# EAGLE design RS232toTTL (EAGLE 5.09)
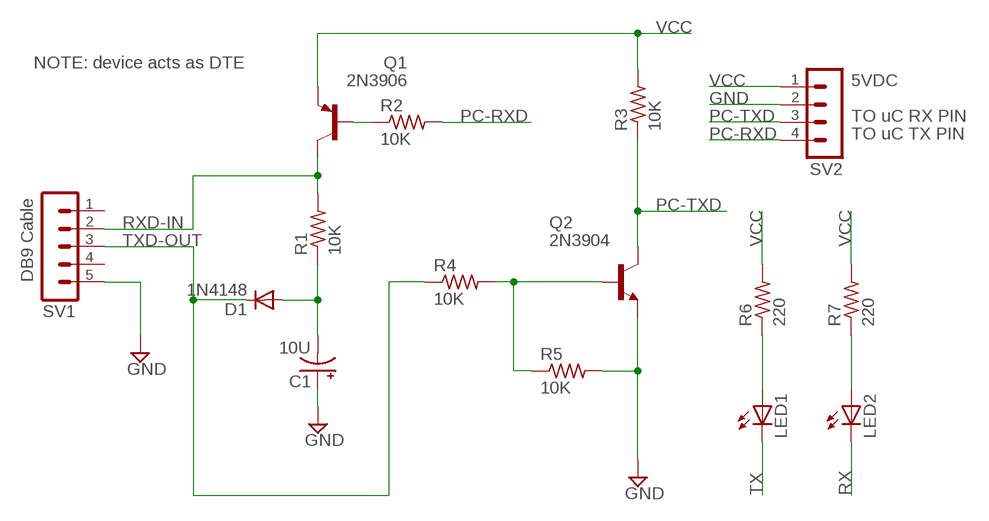
[diagram p0: schematic, sheet 1]

## Parts
C1  10U  CPOL-USE2.5-5  [E2,5-5]
D1  1N4148  1N4148DO35-7  [DO35-7]
LED1  LED5MM  [LED5MM]
LED2  LED5MM  [LED5MM]
Q1  2N3906  [TO92]
Q2  2N3904  [TO92]
R1  10K  R-US_0207/10  [0207/10]
R2  10K  R-US_0207/10  [0207/10]
R3  10K  R-US_0207/10  [0207/10]
R4  10K  R-US_0207/10  [0207/10]
R5  10K  R-US_0207/10  [0207/10]
R6  220  R-US_0207/10  [0207/10]
R7  220  R-US_0207/10  [0207/10]
SV1  MA05-1  [MA05-1]
SV2  MA04-1  [MA04-1]

## Nets
GND: C1.+ Q2.3(E) R5.2 SV1.5 SV2.2
N$1: Q2.2(B) R4.2 R5.1
N$3: Q1.2(B) R2.1
N$6: LED1.A R6.1
N$7: C1.- D1.A R1.1
N$9: LED2.A R7.1
PC-RXD: R2.2 SV2.4
PC-TXD: Q2.1(C) R3.1 SV2.3
RX: LED2.K(C)
RXD-IN: Q1.1(C) R1.2 SV1.2
TX: LED1.K(C)
TXD-OUT: D1.C R4.1 SV1.3
VCC: Q1.3(E) R3.2 R6.2 R7.2 SV2.1
Unconnected: SV1.1 SV1.4

## Notes on the sheet
- NOTE: device acts as DTE
- 5VDC
- TO uC RX PIN
- TO uC TX PIN
- DB9 Cable

## Library data of the parts
C1 = rcl:CPOL-US: POLARIZED CAPACITOR, American symbol
D1 = diode:1N4148: DIODE high speed (Philips)
LED1 LED2 = led:LED: LED OSRAM: - CHIPLED LG R971, LG N971, LY N971, LG Q971, LY Q971, LO R971, LY R971 LH N974, LH R974 LS Q976, LO Q976, LY Q976 LO Q996 - Hyper CHIPLED LW Q18S LB Q993, LB Q99A, LB R99A - SideLED LS A670, LO A670, LY A670, LG A670, LP A670 LB A673, LV A673, LT A673, LW A673 LH A674 LY A675 LS A676, LA A676, LO A676, LY A676, LW A676 LS A679, LY A679, LG A679 - Hyper Micro SIDELED® LS Y876, LA Y876, LO Y876, LY Y876 LT Y87S - SmartLED LW L88C, LW L88S LB L89C, LB L89S, LG L890 LS L89K, LO L89K, LY L89K LS L896, LA L896, LO L896, LY L896 - TOPLED LS T670, LO T670, LY T670, LG T670, LP T670 LSG T670, LSP T670, LSY T670, LOP T670, LYG T670 LG T671, LOG T671, LSG T671 LB T673, LV T673, LT T673, LW T673 LH T674 LS T676, LA T676, LO T676, LY T676, LB T676, LH T676, LSB T676, LW T676 LB T67C, LV T67C, LT T67C, LS T67K, LO T67K, LY T67K, LW E67C LS E67B, LA E67B, LO E67B, LY E67B, LB E67C, LV E67C, LT E67C LW T67C LS T679, LY T679, LG T679 LS T770, LO T770, LY T770, LG T770, LP T770 LB T773, LV T773, LT T773, LW T773 LH T774 LS E675, LA E675, LY E675, LS T675 LS T776, LA T776, LO T776, LY T776, LB T776 LHGB T686 LT T68C, LB T68C - Hyper Mini TOPLED® LB M676 - Mini TOPLED Santana® LG M470 LS M47K, LO M47K, LY M47K Source: http://www.osram.convergy.de LUXEON: - LUMILED® LXK2-PW12-R00, LXK2-PW12-S00, LXK2-PW14-U00, LXK2-PW14-V00 LXK2-PM12-R00, LXK2-PM12-S00, LXK2-PM14-U00 LXK2-PE12-Q00, LXK2-PE12-R00, LXK2-PE12-S00, LXK2-PE14-T00, LXK2-PE14-U00 LXK2-PB12-K00, LXK2-PB12-L00, LXK2-PB12-M00, LXK2-PB14-N00, LXK2-PB14-P00, LXK2-PB14-Q00 LXK2-PR12-L00, LXK2-PR12-M00, LXK2-PR14-Q00, LXK2-PR14-R00 LXK2-PD12-Q00, LXK2-PD12-R00, LXK2-PD12-S00 LXK2-PH12-R00, LXK2-PH12-S00 LXK2-PL12-P00, LXK2-PL12-Q00, LXK2-PL12-R00 Source: www.luxeon.com KINGBRIGHT: KA-3528ASYC Source: www.kingbright.com
Q1 = transistor-pnp:2N3906: PNP Transistor
Q2 = transistor-npn:2N3904: NPN Transistor
R1-R7 = rcl:R-US_: RESISTOR, American symbol
SV1 = con-lstb:MA05-1: PIN HEADER
SV2 = con-lstb:MA04-1: PIN HEADER

## Board
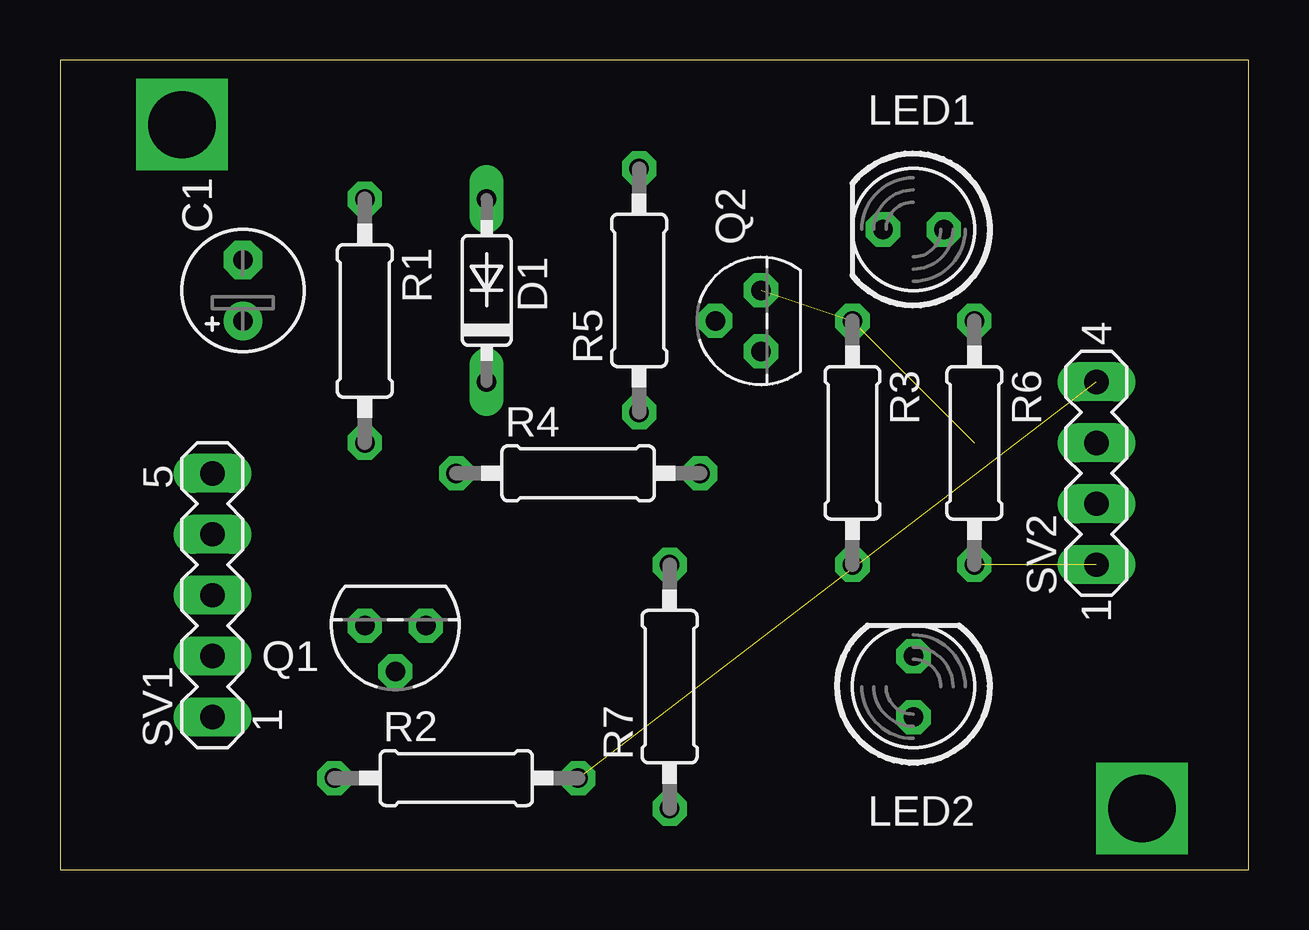
[diagram p1: board, top side]
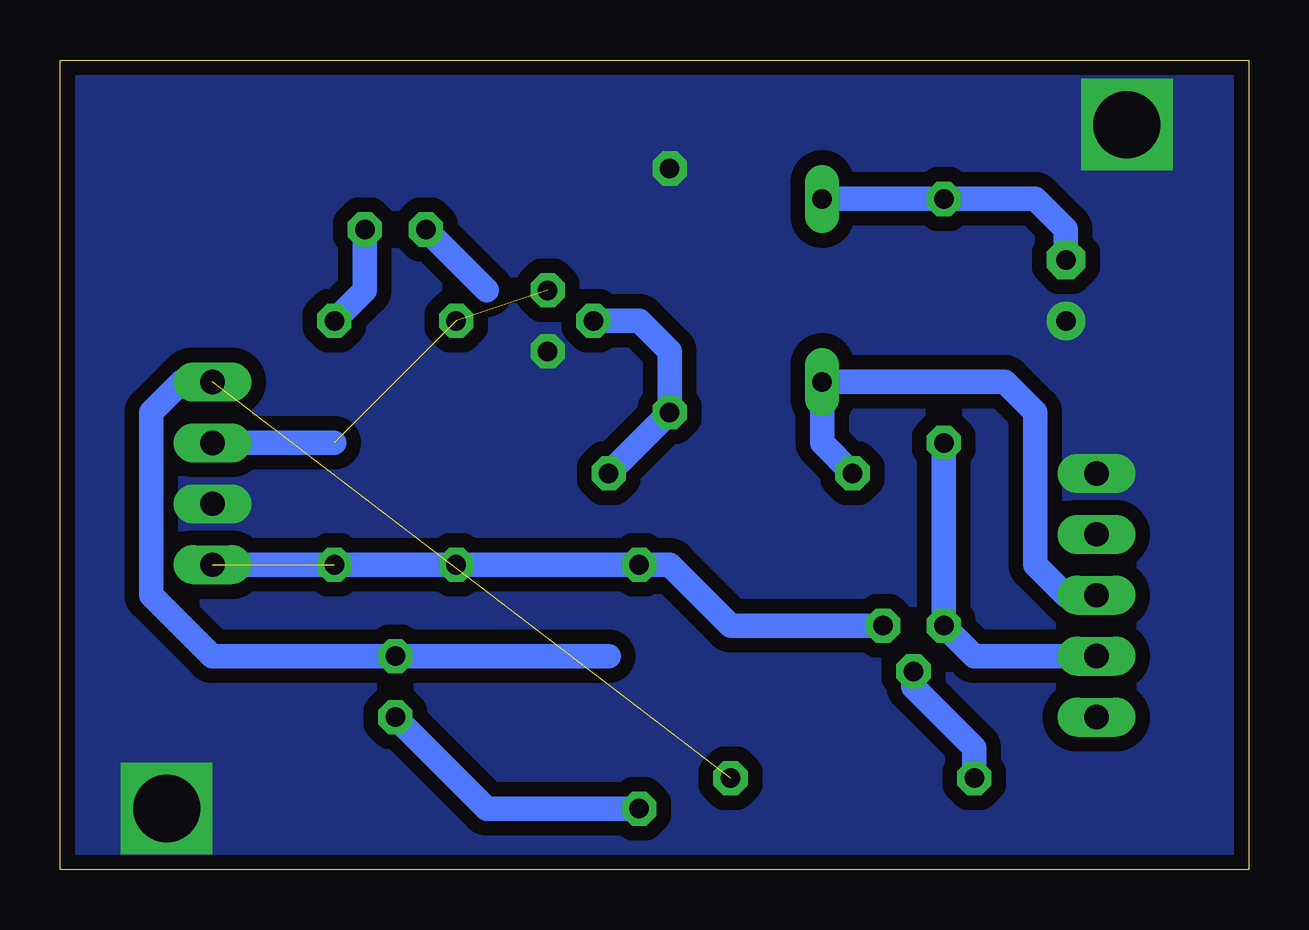
[diagram p2: board, bottom side, seen from below]

Size 49.53 x 33.73 mm. Coordinates in mm from the lower left corner, seen from the top.
Outline: 0,0 49.53,0 49.53,33.73 0,33.73 0,0
Copper layers (1*16): Top 0.035mm / dielectric 1.5mm / Bottom 0.035mm
Design rules "SparkFun": minimum track width 8mil, minimum drill 20mil, track to track 8mil, track to pad 8mil, pad to pad 8mil, via to via 8mil, smd to smd 8mil, copper to edge 10mil, drill to drill 8mil, minimum pad ring 12mil, minimum via ring 10mil, stop-mask expansion 4mil, vias tented up to drill 25mil, thermal gap 10mil

### Footprints (pad centres in the part's own frame; a part is rotated, then mirrored left to right if it is on the bottom)
E2,5-5 = drill 0.813 pad 1.6 round: + -1.27,0 | drill 0.813 pad 1.6 octagon: - 1.27,0
DO35-7 = drill 0.813 long: A 3.81,0; C -3.81,0
LED5MM = drill 0.813 octagon: A -1.27,0; K 1.27,0
TO92 = drill 0.813 octagon: 1 1.27,0; 2 0,1.905; 3 -1.27,0
0207/10 = drill 0.813 octagon: 1 -5.08,0; 2 5.08,0
MA05-1 = drill 1.016 long: 1 -5.08,0; 2 -2.54,0; 3 0,0; 4 2.54,0; 5 5.08,0
MA04-1 = drill 1.016 long: 1 -3.81,0; 2 -1.27,0; 3 1.27,0; 4 3.81,0

### Placement (x,y rotation side)
C1  7.62,24.13 90 top
D1  17.78,24.13 90 top
LED1  35.56,26.67 180 top
LED2  35.56,7.62 90 top
Q1  13.97,10.16 180 top
Q2  29.21,22.86 90 top
R1  12.7,22.86 270 top
R2  16.51,3.81 0 top
R3  33.02,17.78 270 top
R4  21.59,16.51 0 top
R5  24.13,24.13 90 top
R6  38.1,17.78 270 top
R7  25.4,7.62 90 top
SV1  6.35,11.43 90 top
SV2  43.18,16.51 90 top

### Tracks (layer width: path | path; a pad name or v marks a point on that pad's centre or on a via)
GND  (via drill 2.8)
  other vias: 5.08,31.04 45.09,2.54
  pour Bottom (isolate 0.61, no thermals): 0,34.29 49.53,34.29 49.53,0 0,0
N$1
  Bottom 1.016: R4.2 R5.1 24.13,21.59 25.4,22.86 Q2.2
N$3
  Bottom 1.016: R2.1 11.43,5.08 13.97,7.62 Q1.2
N$6
  Bottom 1.016: LED1.A 36.83,24.13 R6.1
N$7
  Bottom 1.016: C1.- 7.62,26.67 8.89,27.94 R1.1 D1.A
N$9
  Bottom 1.016: LED2.A 31.75,2.54 R7.1
PC-RXD  (1 unrouted)
PC-TXD  (2 unrouted)
  Bottom 1.016: 38.1,17.78 SV2.3
RX
  Bottom 1.016: 26.67,8.89 LED2.K 43.18,8.89 45.72,11.43 45.72,19.05 44.45,20.32
RXD-IN
  Bottom 1.016: R1.2 Q1.1 11.43,8.89 SV1.2
TX
  Bottom 1.016: 31.75,24.13 LED1.K
TXD-OUT
  Bottom 1.016: SV1.3 7.62,11.43 8.89,12.7 8.89,19.05 10.16,20.32 D1.C 17.78,17.78 R4.1
VCC  (1 unrouted)
  Bottom 1.016: SV2.1 R3.2 R7.2 24.13,12.7 21.59,10.16 Q1.3